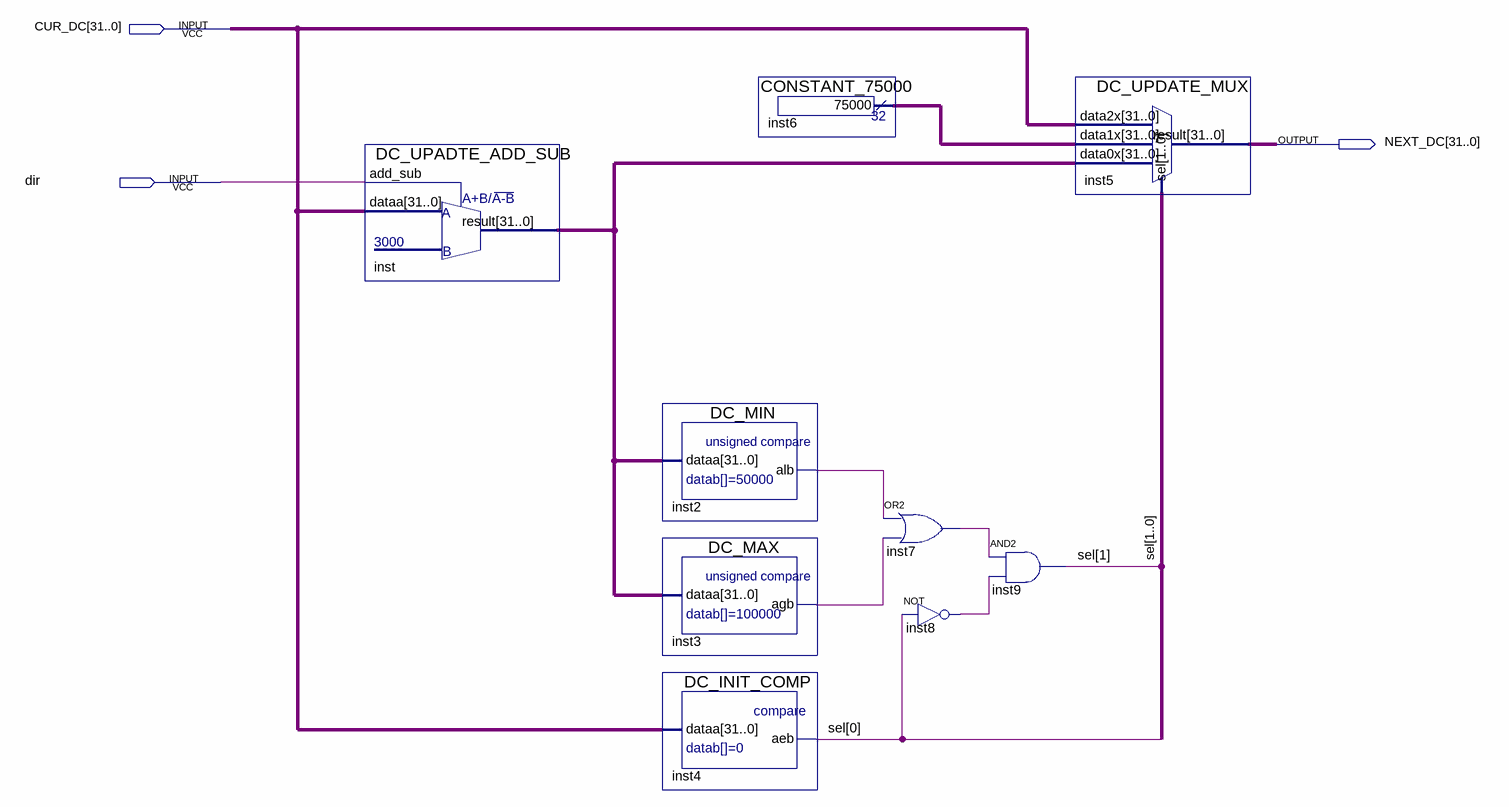
[diagram p0: schematic sheet]
// Quartus schematic dc_update.bdf as structural Verilog: 9 symbols, 3 pins
module dc_update (
  input  [31:0] CUR_DC,
  input  dir,
  output [31:0] NEXT_DC
);

  wire inst2_alb, inst3_agb, inst7_out, inst8_out;
  wire [1:0] sel;
  wire [31:0] inst6_result, inst_result;

  DC_UPADTE_ADD_SUB inst (.add_sub(dir), .dataa(CUR_DC), .result(inst_result));
  DC_MIN inst2 (.dataa(inst_result), .alb(inst2_alb));
  DC_MAX inst3 (.dataa(inst_result), .agb(inst3_agb));
  DC_INIT_COMP inst4 (.dataa(CUR_DC), .aeb(sel[0]));
  CONSTANT_75000 inst6 (.result(inst6_result));
  or inst7 (inst7_out, inst2_alb, inst3_agb);
  not inst8 (inst8_out, sel[0]);
  and inst9 (sel[1], inst7_out, inst8_out);
  DC_UPDATE_MUX inst5 (.data2x(CUR_DC), .data1x(inst6_result), .data0x(inst_result), .sel(sel), .result(NEXT_DC));
endmodule
